# EAGLE design lithium (EAGLE 8.2.1)
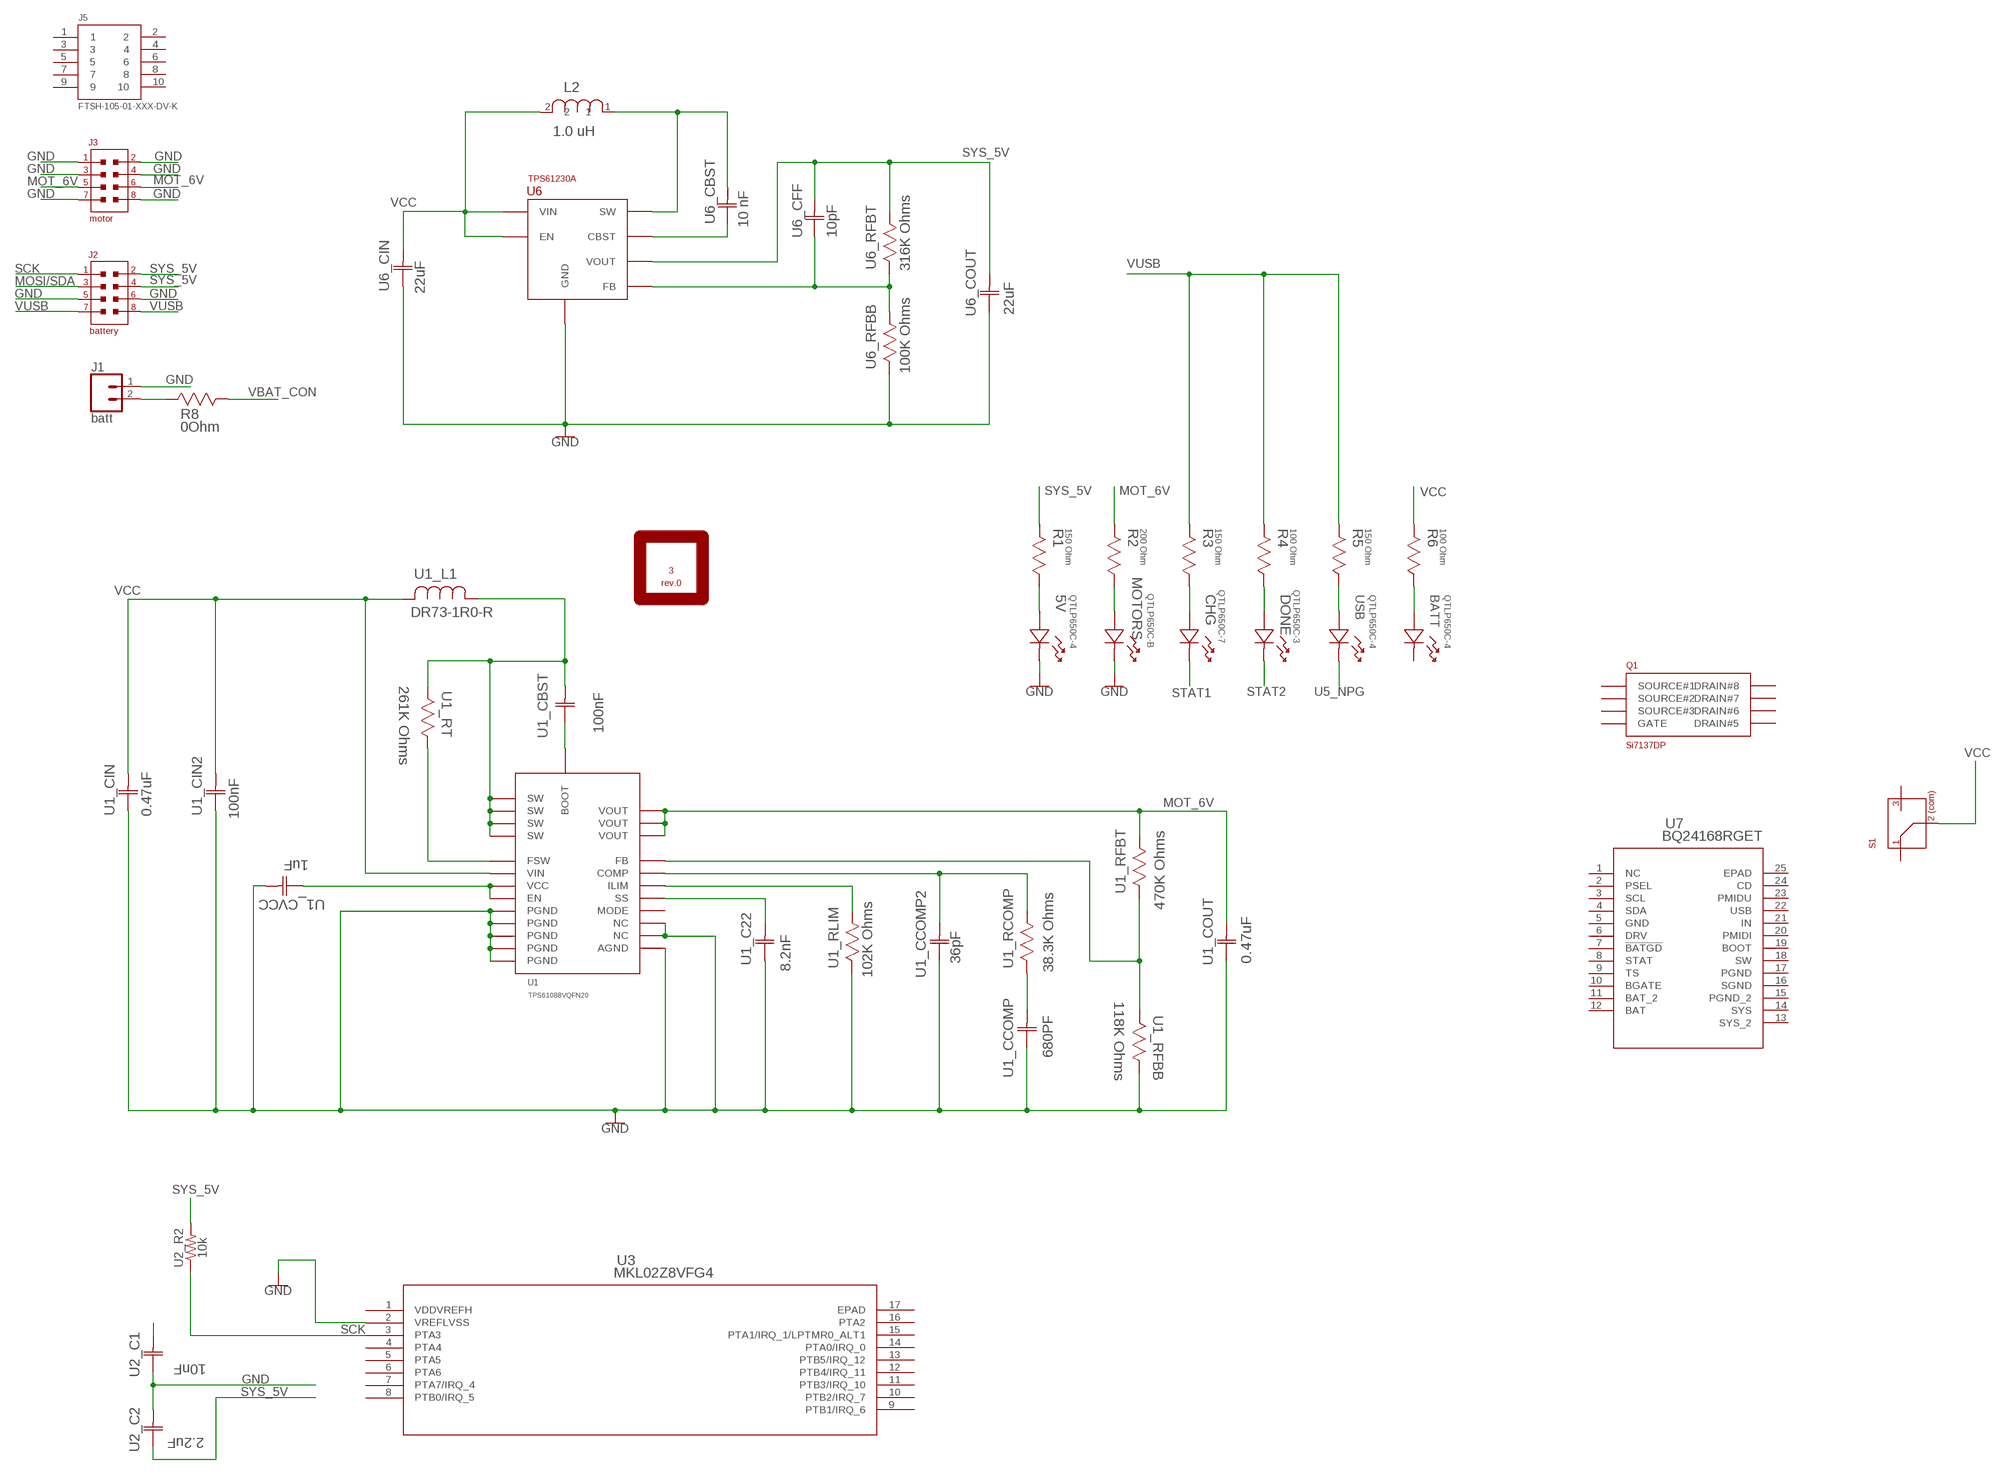
[diagram p0: schematic, sheet 1]

## Parts
3  rev.0  PERIODIC_SYMBOL  [PERIODIC_SYMBOL_BACK]
5V  QTLP650C-4  597-3311-407F  [LED_597-3311-407F]
BATT  QTLP650C-4  597-3311-407F  [LED_597-3311-407F]
CHG  QTLP650C-7  597-3111-407F  [LED_597-3111-407F]
DONE  QTLP650C-3  597-3401-407F  [LED_597-3401-407F]
J1  batt  CONN_02-JST-2MM-SMT  [JST-2-SMD]
J2  battery  2X4-0.01"(2.54MM)-JUMPERSSOCKET  [2X4-0.01"(2.54MM)-SOCKET]
J3  motor  2X4-0.01"(2.54MM)-JUMPERSSOCKET  [2X4-0.01"(2.54MM)-SOCKET]
J5  FTSH-105-01-XXX-DV-K  [FTSH-105-01-XXX-DV-K]
L2  1.0 uH  PM1210-1R0J-RC  [INDC3225X22N]
MOTORS  QTLP650C-B  597-3311-402F  [LED_597-3311-402F]
Q1  Si7137DP  SI7137DP  [SO-8]
R1  150 Ohm  ERA-6AEB151V  [RESC2013X65N]
R2  200 Ohm  ERA-6AEB201V  [RESC2013X65N]
R3  150 Ohm  ERA-6AEB151V  [RESC2013X65N]
R4  100 Ohm  ERA-6AEB101V  [RESC2013X65N]
R5  150 Ohm  ERA-6AEB151V  [RESC2013X65N]
R6  100 Ohm  ERA-6AEB101V  [RESC2013X65N]
R8  0Ohm  CRCW08050000Z0EB  [RESC2013X65N]
S1  SS312SAH4  [SS312SAH4]
U1  TPS61088VQFN20  [VQFN20]
U1_C22  8.2nF  C0402C822K5RACTU  [CAPC1005X60N]
U1_CBST  100nF  08053C104KAT2A  [CAPC2013X94N]
U1_CCOMP  680PF  0603YC681JAT2A  [CAPC1608X90N]
U1_CCOMP2  36pF  C0402C360J5GACTU  [CAPC1005X60N]
U1_CIN  0.47uF  C1206F474K5RACAUTO  [CAPC3216X180N]
U1_CIN2  100nF  GRM155R71C104KA88D  [CAPC1005X60N]
U1_COUT  0.47uF  C1206F474K5RACAUTO  [CAPC3216X180N]
U1_CVCC  1uF  GRM188R60J105KA01D  [CAPC1608X85N]
U1_L1  DR73-1R0-R  [INDM7676X355N]
U1_RCOMP  38.3K Ohms  CRCW040238K3FKED  [RESC1005X40N]
U1_RFBB  118K Ohms  CRCW0402118KFKED  [RESC1005X40N]
U1_RFBT  470K Ohms  RC0603FR-07470KL  [RESC1608X60N]
U1_RLIM  102K Ohms  CRCW0402102KFKED  [RESC1005X40N]
U1_RT  261K Ohms  CRCW0402261KFKED  [RESC1005X40N]
U2_C1  10nF  CC0402KRX7R7BB103  [CAPC1005X55N]
U2_C2  2.2uF  0402ZD225KAT2A  [CAPC1005X60N]
U2_R2  10k  RESISTOR0402  [0402]
U3  MKL02Z8VFG4  [QFN-16_3X3X0.65]
U6  TPS61230A  [VQFN7]
U6_CBST  10 nF  C0402C103K5RACTU  [CAPC1005X60N]
U6_CFF  10pF  C0603C100J5GACTU  [CAPC1608X85N]
U6_CIN  22uF  GRM21BR60J226ME39L  [CAPC2013X135N]
U6_COUT  22uF  GRM32ER61C226KE20L  [CAPC3225X270N]
U6_RFBB  100K Ohms  CRCW0402100KFKED  [RESC1005X40N]
U6_RFBT  316K Ohms  CRCW0402316KFKED  [RESC1005X40N]
U7  BQ24168RGET  [RGE24_2P7X2P7]
USB  QTLP650C-4  597-3311-407F  [LED_597-3311-407F]

## Nets
BOOT: U1.P$8(BOOT) U1_CBST.1(C1)
FB: U1.P$17(FB) U1_RFBB.2 U1_RFBT.2(R2)
FSW: U1.P$3(FSW) U1_RT.1
GND: 5V.1 J1.1 J2.P$5 J2.P$6 J3.P$1 J3.P$2 J3.P$3 J3.P$4 J3.P$7 J3.P$8 MOTORS.1 U1.P$11(NC) U1.P$12(NC) U1.P$20(AGND) U1.P$21(PGND) U1.P$22(PGND) U1.P$23(PGND) U1.P$24(PGND) U1.P$25(PGND) U1_C22.1(C1) U1_CCOMP2.1(C1) U1_CCOMP.1(C1) U1_CIN2.1(C1) U1_CIN.1(C1) U1_COUT.1(C1) U1_CVCC.2(C2) U1_RFBB.1 U1_RLIM.2 U2_C1.1(C1) U2_C2.1(C2) U3.2(VREFLVSS) U6.P$6(GND) U6_CIN.1(C1) U6_COUT.1(C1) U6_RFBB.2
ILIM: U1.P$19(ILIM) U1_RLIM.1
LA_5: 5V.2 R1.1(R1)
LA_6: MOTORS.2 R2.1(R1)
LA_BATT: BATT.2 R6.1(R1)
LA_CHG: CHG.2 R3.1(R1)
LA_DONE: DONE.2 R4.1(R1)
LA_USB: R5.1(R1) USB.2
MOSI/SDA: J2.P$3
MOT_6V: J3.P$5 J3.P$6 R2.2(R2) U1.P$14(VOUT) U1.P$15(VOUT) U1.P$16(VOUT) U1_COUT.2(C2) U1_RFBT.1(R1)
N$1: U1_CCOMP.2(C2) U1_RCOMP.2
SCK: J2.P$1 U2_R2.1 U3.3(PTA3)
SS: U1.P$10(SS) U1_C22.2(C2)
STAT1: CHG.1
STAT2: DONE.1
SW: U1.P$4(SW) U1.P$5(SW) U1.P$6(SW) U1.P$7(SW) U1_CBST.2(C2) U1_L1.1 U1_RT.2
SYS_5V: J2.P$2 J2.P$4 R1.2(R2) U2_C1.2(C2) U2_C2.2(C1) U2_R2.2 U6.P$7(VOUT) U6_CFF.2(C2) U6_COUT.2(C2) U6_RFBT.1
U1_COMP: U1.P$18(COMP) U1_CCOMP2.2(C2) U1_RCOMP.1
U1_VCC: U1.P$1(VCC) U1.P$2(EN) U1_CVCC.1(C1)
U5_NPG: USB.1
U6_CBST: U6.P$1(CBST) U6_CBST.1(C1)
U6_FB: U6.P$3(FB) U6_CFF.1(C1) U6_RFBB.1 U6_RFBT.2
U6_SW: L2.1 U6.P$5(SW) U6_CBST.2(C2)
VBAT_CON: R8.1
VBAT_JST: J1.2 R8.2
VCC: L2.2 R6.2(R2) S1.P$2 U1.P$9(VIN) U1_CIN2.2(C2) U1_CIN.2(C2) U1_L1.2 U6.P$2(EN) U6.P$4(VIN) U6_CIN.2(C2)
VUSB: J2.P$7 J2.P$8 R3.2(R2) R4.2(R2) R5.2(R2)
Unconnected: BATT.1 J5.1 J5.2 J5.3 J5.4 J5.5 J5.6 J5.7 J5.8 J5.9 J5.10 Q1.P$1(SOURCE#1) Q1.P$2(SOURCE#2) Q1.P$3(SOURCE#3) Q1.P$4(GATE) Q1.P$5(DRAIN#5) Q1.P$6(DRAIN#6) Q1.P$7(DRAIN#7) Q1.P$8(DRAIN#8) Q1.P$9(DRAIN#8) S1.P$1 S1.P$3 U1.P$13(MODE) U3.4(PTA4) U3.5(PTA5) U3.6(PTA6) U3.7(PTA7/IRQ_4) U3.8(PTB0/IRQ_5) U3.9(PTB1/IRQ_6) U3.10(PTB2/IRQ_7) U3.11(PTB3/IRQ_10) U3.12(PTB4/IRQ_11) U3.13(PTB5/IRQ_12) U3.14(PTA0/IRQ_0) U3.15(PTA1/IRQ_1/LPTMR0_ALT1) U3.16(PTA2) U3.17(EPAD) U7.1(NC) U7.2(PSEL) U7.3(SCL) U7.4(SDA) U7.6(DRV) U7.7(!BATGD) U7.8(STAT) U7.9(TS) U7.10(BGATE) U7.11(BAT_2) U7.12(BAT) U7.13(SYS_2) U7.14(SYS) U7.18(SW) U7.19(BOOT) U7.20(PMIDI) U7.21(IN) U7.22(USB) U7.23(PMIDU) U7.24(CD) U7.25(EPAD)

## Power pins joined to a net without a drawn wire
GND: U7.5(GND)
PGND: U7.17(PGND)
PGND_2: U7.15(PGND_2)
SGND: U7.16(SGND)
VDDVREFH: U3.1(VDDVREFH)

## Library data of the parts
3 = 32bits:PERIODIC_SYMBOL; ELEMENT: Li
5V BATT USB = Dialight_By_element14_Batch_1:597-3311-407F: LED 1206 Green SMT; COLOR: Green; MPN: 597-3311-407F; OC_FARNELL: 1519493; OC_NEWARK: 30K4957; PACKAGE: 1206- Green LED; SUPPLIER: Dialight
CHG = Dialight_By_element14_Batch_1:597-3111-407F: LED 1206 ALGAAS RED SMT; COLOR: AlGaAs Red; MPN: 597-3111-407F; OC_FARNELL: 1519490; OC_NEWARK: 30K4900; PACKAGE: 1206-RED LED; SUPPLIER: Dialight
DONE = Dialight_By_element14_Batch_1:597-3401-407F: LED 1206 Yellow SMT; COLOR: Yellow; MPN: 597-3401-407F; OC_FARNELL: 1519495; OC_NEWARK: 30K4970; PACKAGE: 1206-Yellow LED; SUPPLIER: Dialight
J1 = SparkFun-Connectors:CONN_02: Multi connection point. Often used as Generic Header-pin footprint for 0.1 inch spaced/style header connections On any of the 0.1 inch spaced packages, you can populate with these: Break Away Headers - Straight <https://www.sparkfun.com/products/116> (PRT-00116) Break Away Male Headers - Right Angle <https://www.sparkfun.com/products/553> (PRT-00553) Female Headers <https://www.sparkfun.com/products/115> (PRT-00115) Break Away Headers - Machine Pin <https://www.sparkfun.com/products/117> (PRT-00117) Break Away Female Headers - Swiss Machine Pin <https://www.sparkfun.com/products/743> (PRT-00743) For SCREWTERMINALS and SPRING TERMINALS visit here: Screw Terimnals on SparkFun.com <https://www.sparkfun.com/search/results?term=Screw+Terminals> (5mm/3.5mm/2.54mm spacing) This device is also useful as a general connection point to wire up your design to another part of your project. Our various solder wires solder well into these plated through hole pads. Hook-Up Wire - Assortment (Stranded, 22 AWG) <https://www.sparkfun.com/products/11375> (PRT-11375) Hook-Up Wire - Assortment (Solid Core, 22 AWG) <https://www.sparkfun.com/products/11367> (PRT-11367) View the entire wire category on our website here <https://www.sparkfun.com/categories/141> Special notes: Molex polarized connector foot print use with: PRT-08233 with associated crimp pins and housings. 2.54_SCREWTERM for use with PRT-10571. 3.5mm Screw Terminal footprints for PRT-08084 5mm Screw Terminal footprints for use with PRT-08432; PROD_ID: CONN-11443
J2 J3 = 32bits:2X4-0.01"(2.54MM)-JUMPERS: Variant Manufacturer part no. HEADERS Amphenol FCI 95278-101A10LF SOCKET Sullins NPxCxx2KFMx-RC
J5 = FTSH-105-01-XXX-DV-K:FTSH-105-01-XXX-DV-K: 0.05"x0.05" DOUBLE ROW SMT STRIP ASSEMBLY. MANUFACTURER:SAMTEC.
L2 = Bourns_By_element14_Batch_1:PM1210-1R0J-RC: CHIP INDUCTOR, 1UH, 400MA 5% 120MHZ; MPN: PM1210-1R0J-RC; OC_FARNELL: 1180462; OC_NEWARK: 63K3090; SUPPLIER: BOURNS; TOLERANCE: ±5 %
MOTORS = Dialight_By_element14_Batch_1:597-3311-402F: LED 1206 Green SMT; COLOR: Green; MPN: 597-3311-402F; OC_FARNELL: 1179613; OC_NEWARK: 30K4956; PACKAGE: 1206- Green LED; SUPPLIER: Dialight
Q1 = 32bits:SI7137DP: P-Channel 20-V (D-S) MOSFET Vishay Siliconix RDS: 0.0025 at VGS = - 4.5 V
R1 R3 R5 = Panasonic_By_element14_Batch_1:ERA-6AEB151V: RESISTOR, 0805; MPN: ERA-6AEB151V; OC_FARNELL: 1811409; OC_NEWARK: 08N2149; SUPPLIER: Panasonic; TOLERANCE: ±0.1 %; WATTAGE: 0.125 W
R2 = Panasonic_By_element14_Batch_1:ERA-6AEB201V: RESISTOR, 0805; MPN: ERA-6AEB201V; OC_FARNELL: 1670217; OC_NEWARK: 40P0007; SUPPLIER: Panasonic; TOLERANCE: ±0.1 %; WATTAGE: 0.125 W
R4 R6 = Panasonic_By_element14_Batch_1:ERA-6AEB101V: RESISTOR, 0805; MPN: ERA-6AEB101V; OC_FARNELL: 1811403; OC_NEWARK: 08N2140; SUPPLIER: Panasonic; TOLERANCE: ±0.1 %; WATTAGE: 0.125 W
R8 = Vishay_By_element14_Batch_1:CRCW08050000Z0EB: RESISTOR, 0805; MPN: CRCW08050000Z0EB; OC_FARNELL: 1853266; OC_NEWARK: 48P9971; SUPPLIER: Vishay; TOLERANCE: Jumper; WATTAGE: 0.125W
S1 = 32bits:SS312SAH4: NKK Switches SS312SAH4 ON-ON, SPDT
U1 = 32bits:TPS61088: TPS61088 10-A Fully-Integrated Synchronous Boost Converter Input Voltage Range: 2.7 to 12 V Output Voltage Range: 4.5 to 12.6 V 10-A Switch Current Up to 91% Efficiency at VIN = 3.3 V, VOUT = 9 V, and IOUT = 3 A Mode Selection Between PFM Mode and ForcedPWM Mode at Light Load 1.0 μA Current into VIN Pin during Shutdown Resistor-Programmable Switch Peak Current Limit Adjustable Switching Frequency: 200 kHz to 2.2MHz Programmable Soft Start Output Overvoltage Protection at 13.2 V Cycle-by-Cycle Overcurrent Protection Thermal Shutdown 4.50-mm × 3.50-mm 20-Pin VQFN Package Description The TPS61088 is a high power density, fully integrated synchronous boost converter with a 11-mΩ power switch and a 13-mΩ rectifier switch to provide a high efficiency and small size solution in portable systems. The TPS61088 has wide input voltage range from 2.7 V to 12 V to support applications with single cell or two cell Lithium batteries. The device has 10-A switch current capability and is capable of providing an output voltage up to 12.6 V. The TPS61088 uses adaptive constant off-time peak current control topology to regulate the output voltage. In moderate to heavy load condition, the TPS61088 works in the pulse width modulation (PWM) mode. In light load condition, the device has two operation modes selected by the MODE pin. One is the pulse frequency modulation (PFM) mode to improve the efficiency and another one is the forced PWM mode to avoid application problems caused by low switching frequency. The switching frequency in the PWM mode is adjustable ranging from 200 kHz to 2.2 MHz by an external resistor. The TPS61088 also implements a programmable soft-start function and an adjustable switching peak current limit function. In addition, the device provides 13.2-V output overvoltage protection, cycle-by-cycle overcurrent protection, and thermal shutdown protection. The TPS61088 is available in a 4.50-mm × 3.50-mm 20-pin VQFN package.; TYPE: boost
U1_C22 = Kemet_By_element14_Batch_1:C0402C822K5RACTU: CAPACITOR, 0402; MPN: C0402C822K5RACTU; OC_FARNELL: 1865460; OC_NEWARK: 29T8966; SUPPLIER: KEMET; TOLERANCE: ±10%; VOLTAGERATING: 50V
U1_CBST = AVX_By_element14_Batch_1:08053C104KAT2A: Capacitor 0805; MPN: 08053C104KAT2A; OC_FARNELL: 1740665; OC_NEWARK: 96M1381; SUPPLIER: AVX; TOLERANCE: ±10%; VOLTAGERATING: 25V
U1_CCOMP = AVX_By_element14_Batch_1:0603YC681JAT2A: Capacitor, 0603; MPN: 0603YC681JAT2A; OC_FARNELL: -; OC_NEWARK: 55J2711; SUPPLIER: AVX; TOLERANCE: ±5%; VOLTAGERATING: 16V
U1_CCOMP2 = Kemet_By_element14_Batch_1:C0402C360J5GACTU: CAPACITOR, 0402; MPN: C0402C360J5GACTU; OC_FARNELL: 1865427; OC_NEWARK: 29T8949; SUPPLIER: KEMET; TOLERANCE: ±5%; VOLTAGERATING: 50V
U1_CIN U1_COUT = Kemet_By_element14_Batch_1:C1206F474K5RACAUTO: CAPACITOR, 1206; MPN: C1206F474K5RACAUTO; OC_FARNELL: 1869060; OC_NEWARK: 32T6755; SUPPLIER: KEMET; TOLERANCE: ±10%; VOLTAGERATING: 50V
U1_CIN2 = Murata_By_element14_Batch_1:GRM155R71C104KA88D: CAPACITOR, 0402; MPN: GRM155R71C104KA88D; OC_FARNELL: 8819742; OC_NEWARK: 38K1647; SUPPLIER: Murata; TOLERANCE: ±10%; VOLTAGERATING: 16V
U1_CVCC = Murata_By_element14_Batch_1:GRM188R60J105KA01D: CAPACITOR, 0603; MPN: GRM188R60J105KA01D; OC_FARNELL: 9527699; OC_NEWARK: 97K0609; SUPPLIER: Murata; TOLERANCE: ±10%; VOLTAGERATING: 6.3V
U1_L1 = Coiltronics_By_element14_Batch_1:DR73-1R0-R: POWER INDUCTOR; CURRENTRATING: 5.28A; INDUCTANCE: 1µH; MPN: DR73-1R0-R; OC_FARNELL: 1463503; OC_NEWARK: 29K6167; PACKAGE: SMD; SUPPLIER: COILTRONICS; TOLERANCE: ±20%
U1_RCOMP = Vishay_By_element14_Batch_1:CRCW040238K3FKED: RESISTOR, 0402; MPN: CRCW040238K3FKED; OC_FARNELL: 1151219; OC_NEWARK: 52K7021; SUPPLIER: VISHAY DALE ELECTRONICS; TOLERANCE: ±1%; WATTAGE: 0.063 W
U1_RFBB = Vishay_By_element14_Batch_1:CRCW0402118KFKED: RESISTOR, 0402; MPN: CRCW0402118KFKED; OC_FARNELL: 1652743; OC_NEWARK: 52K6643; SUPPLIER: Vishay; TOLERANCE: ±1%; WATTAGE: 0.063W
U1_RFBT = Yageo_By_element14_Batch_1:RC0603FR-07470KL: RESISTOR, 0603; MPN: RC0603FR-07470KL; OC_FARNELL: 1117267; OC_NEWARK: 68R0098; SUPPLIER: Yageo; TOLERANCE: ±1%; WATTAGE: 1/10 W
U1_RLIM = Vishay_By_element14_Batch_1:CRCW0402102KFKED: RESISTOR, 0402; MPN: CRCW0402102KFKED; OC_FARNELL: 1150767; OC_NEWARK: 52K6611; SUPPLIER: VISHAY DALE ELECTRONICS; TOLERANCE: ±1%; WATTAGE: 0.063 W
U1_RT = Vishay_By_element14_Batch_1:CRCW0402261KFKED: RESISTOR, 0402; MPN: CRCW0402261KFKED; OC_FARNELL: 1151087; OC_NEWARK: 52K6902; SUPPLIER: VISHAY DALE ELECTRONICS; TOLERANCE: ±1%; WATTAGE: 0.063 W
U2_C1 = Yageo_By_element14_Batch_1:CC0402KRX7R7BB103: CAPACITOR, 0402; MPN: CC0402KRX7R7BB103; OC_FARNELL: 3019275; OC_NEWARK: 68R4639; SUPPLIER: Yageo; TOLERANCE: ±10%; VOLTAGERATING: 16V
U2_C2 = AVX_By_element14_Batch_1:0402ZD225KAT2A: Capacitor 0402; MPN: 0402ZD225KAT2A; OC_FARNELL: 1867952; OC_NEWARK: -; SUPPLIER: AVX; TOLERANCE: ±10%; VOLTAGERATING: 10V
U2_R2 = SparkFun-Resistors:RESISTOR: Generic Resistor Package
U3 = 32bits:MKL02Z8VFG4; CPU: ARM CortexM0+; FLASHKB: 8; MANUFACTURER_PART_NUMBER: mkl02z8vfg4; MAXFREQUENCY: 48; PINCOUNT: 16; SRAMKB: 1; VENDOR: FREESCALE
U6 = 32bits:TPS61230A
U6_CBST = Kemet_By_element14_Batch_1:C0402C103K5RACTU: CAPACITOR, 0402; MPN: C0402C103K5RACTU; OC_FARNELL: 1414575; OC_NEWARK: 78H4783; SUPPLIER: Kemet; TOLERANCE: ±10%; VOLTAGERATING: 50V
U6_CFF = Kemet_By_element14_Batch_1:C0603C100J5GACTU: CAPACITOR, 0603; MPN: C0603C100J5GACTU; OC_FARNELL: 1414601; OC_NEWARK: 64K2831; SUPPLIER: Kemet; TOLERANCE: ±5%; VOLTAGERATING: 50V
U6_CIN = Murata_By_element14_Batch_1:GRM21BR60J226ME39L: CAPACITOR, 0805; MPN: GRM21BR60J226ME39L; OC_FARNELL: 1735531; OC_NEWARK: 24R6338; SUPPLIER: Murata; TOLERANCE: ±20%; VOLTAGERATING: 6.3V
U6_COUT = Murata_By_element14_Batch_1:GRM32ER61C226KE20L: CAPACITOR, 1210; MPN: GRM32ER61C226KE20L; OC_FARNELL: 9527800; OC_NEWARK: 97K0673; SUPPLIER: Murata; TOLERANCE: ±10%; VOLTAGERATING: 16V
U6_RFBB = Vishay_By_element14_Batch_1:CRCW0402100KFKED: RESISTOR, 0402; MPN: CRCW0402100KFKED; OC_FARNELL: 1469671; OC_NEWARK: -; SUPPLIER: Vishay; TOLERANCE: ±1%; WATTAGE: 0.063W
U6_RFBT = Vishay_By_element14_Batch_1:CRCW0402316KFKED: RESISTOR, 0402; MPN: CRCW0402316KFKED; OC_FARNELL: 1652782; OC_NEWARK: 52K6969; SUPPLIER: Vishay; TOLERANCE: ±1%; WATTAGE: 0.063W
U7 = 32bits:BQ24168RGET; MANUFACTURER_PART_NUMBER: bq24168rget; VENDOR: Texas Instruments

## Module TESTMOD
Ports: 

### Library data of the parts

## Board
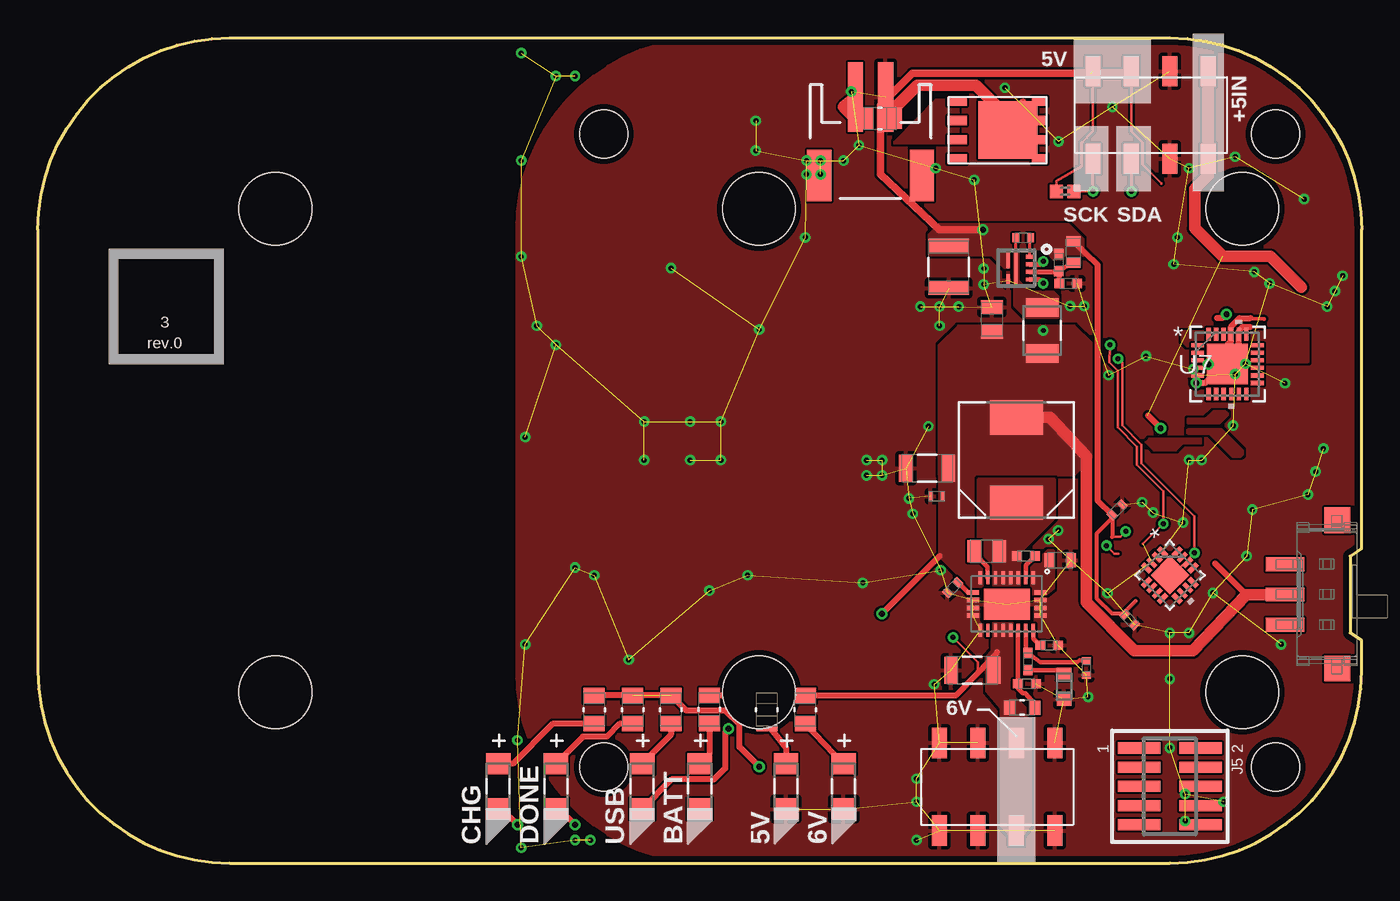
[diagram p1: board, top side]
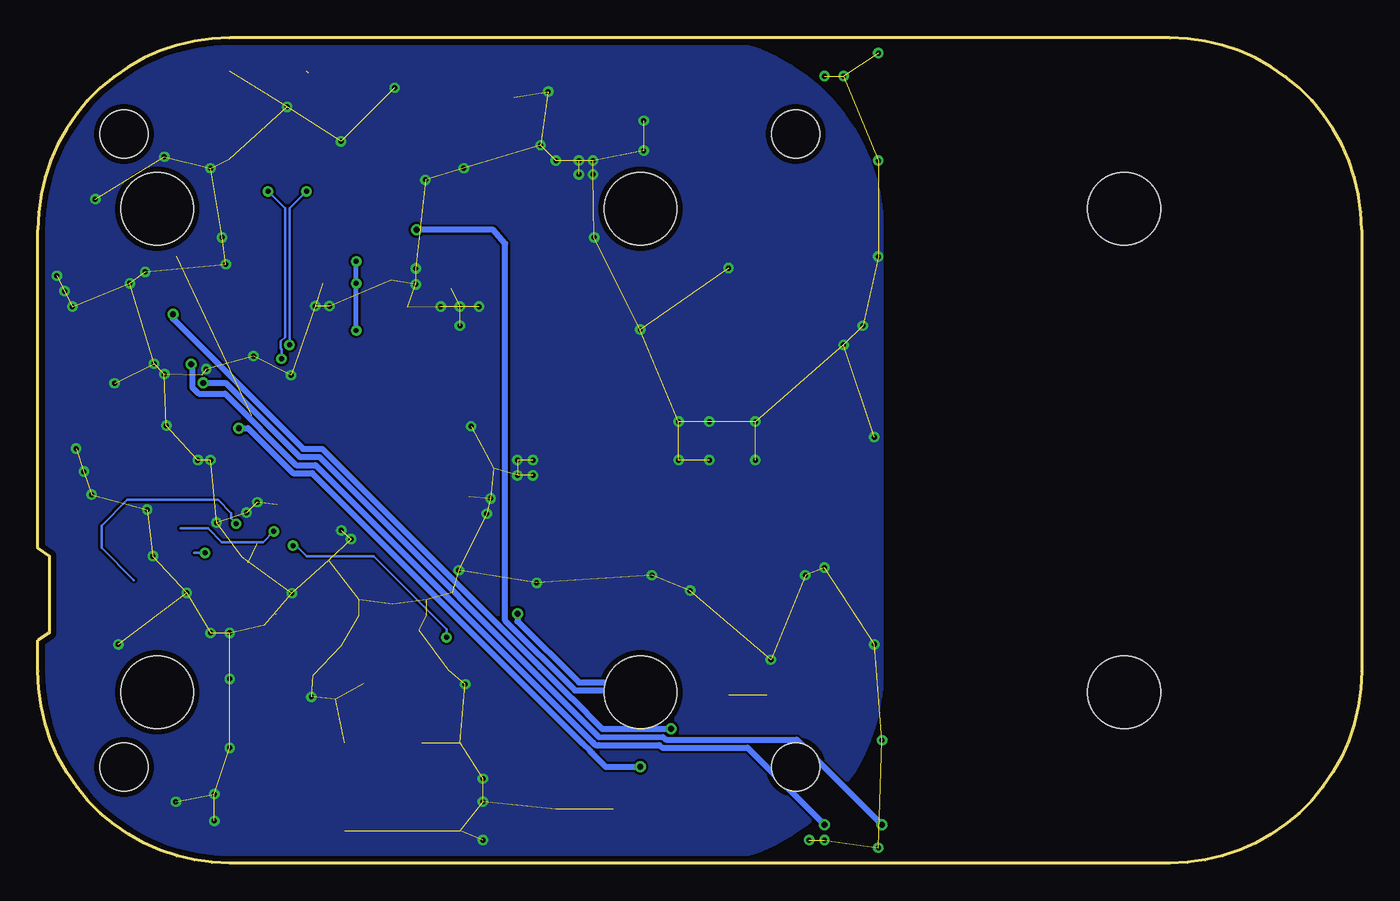
[diagram p2: board, bottom side, seen from below]

Size 87.63 x 54.61 mm. Coordinates in mm from the lower left corner, seen from the top.
Outline: 0,41.91 0,12.7 arc90 12.7,0 74.93,0 arc90 87.63,12.7 87.63,14.73 86.87,15.24 86.87,20.32 87.63,20.83 87.63,41.91 arc90 74.93,54.61 12.7,54.61 arc90 0,41.91
Copper layers (1*16): Top 0.0356mm / dielectric 1.5011mm / Bottom 0.0356mm
Design rules "oshpark-2layer": minimum track width 6mil, minimum drill 13mil, track to track 6mil, track to pad 6mil, pad to pad 6mil, via to via 6mil, smd to smd 6mil, copper to edge 15mil, drill to drill 6mil, minimum pad ring 7mil, minimum via ring 7mil, stop-mask expansion 2.5mil, vias tented up to drill 0mil, thermal gap 10mil
Holes 3.17 mm at 81.92,6.35 81.92,48.26 37.47,48.26 37.47,6.35
Holes 4.8 mm at 79.73,43.3 79.73,11.3 47.73,43.3 47.73,11.3 15.73,43.3 15.73,11.3

### Footprints (pad centres in the part's own frame; a part is rotated, then mirrored left to right if it is on the bottom)
LED_597-3311-407F = smd 1.397 x 1.6: 1 -1.499,0; 2 1.499,0
LED_597-3111-407F = smd 1.397 x 1.6: 1 -1.499,0; 2 1.499,0
LED_597-3401-407F = smd 1.397 x 1.6: 1 -1.499,0; 2 1.499,0
JST-2-SMD = smd 1 x 4.6: 1 -1,-3.7; 2 1,-3.7 | smd 1.6 x 3.4: NC1 -3.4,1.5; NC2 3.4,1.5
2X4-0.01"(2.54MM)-SOCKET = smd 0.991 x 2.007: P$1 0,-1.651; P$2 0,4.14; P$3 2.54,-1.651; P$4 2.54,4.14; P$5 5.08,-1.651; P$6 5.08,4.14; P$7 7.62,-1.651; P$8 7.62,4.14
FTSH-105-01-XXX-DV-K = smd 0.737 x 2.794: 1 -2.54,-2.032; 2 -2.54,2.032; 3 -1.27,-2.032; 4 -1.27,2.032; 5 0,-2.032; 6 0,2.032; 7 1.27,-2.032; 8 1.27,2.032; 9 2.54,-2.032; 10 2.54,2.032
INDC3225X22N = smd 1.245 x 2.159: 1 -1.524,0; 2 1.524,0
LED_597-3311-402F = smd 1.397 x 1.6: 1 -1.499,0; 2 1.499,0
SO-8 = smd 1.27 x 0.61: P$1 0,0; P$2 0,-1.27; P$3 0,-2.54; P$4 0,-3.81 | smd 1.016 x 0.61: P$5 5.461,-3.81; P$6 5.461,-2.54; P$7 5.461,-1.27; P$8 5.461,0 | smd 3.912 x 3.81: P$9 3.353,-1.905
RESC2013X65N = smd 1.016 x 1.397: 1 -0.94,0; 2 0.94,0
SS312SAH4 = smd 1.702 x 1.702: NC$1 4.902,-3.462; NC$2 -4.902,-3.462 | smd 0.914 x 2.55: P$1 2.007,0; P$2 0,0; P$3 -2.007,0
VQFN20 = smd 0.85 x 0.28: P$1 -2.225,-0.75; P$10 2.225,-0.75; P$11 2.225,0.75; P$20 -2.225,0.75; P$21 -2.225,0.275; P$22 -2.225,-0.275; P$23 2.225,-0.275; P$24 2.225,0.275 | smd 0.28 x 0.85: P$2 -1.75,-1.725; P$3 -1.25,-1.725; P$4 -0.75,-1.725; P$5 -0.25,-1.725; P$6 0.25,-1.725; P$7 0.75,-1.725; P$8 1.25,-1.725; P$9 1.75,-1.725; P$12 1.75,1.725; P$13 1.25,1.725; P$14 0.75,1.725; P$15 0.25,1.725; P$16 -0.25,1.725; P$17 -0.75,1.725; P$18 -1.25,1.725; P$19 -1.75,1.725 | smd 3.05 x 2.05: P$25 0,0
CAPC1005X60N = smd 0.457 x 0.61: 1 -0.483,0; 2 0.483,0
CAPC2013X94N = smd 0.914 x 1.448: 1 -0.813,0; 2 0.813,0
CAPC1608X90N = smd 0.864 x 0.965: 1 -0.813,0; 2 0.813,0
CAPC3216X180N = smd 0.914 x 1.803: 1 -1.397,0; 2 1.397,0
CAPC1005X60N' = smd 0.305 x 0.61: 1 -0.406,0; 2 0.406,0
CAPC1608X85N = smd 0.66 x 0.94: 1 -0.711,0; 2 0.711,0
INDM7676X355N = smd 2.261 x 3.505: 1 -2.819,0; 2 2.819,0
RESC1005X40N = smd 0.66 x 0.61: 1 -0.584,0; 2 0.584,0
RESC1608X60N = smd 0.762 x 0.94: 1 -0.838,0; 2 0.838,0
CAPC1005X55N = smd 0.457 x 0.61: 1 -0.483,0; 2 0.483,0
0402 = smd 0.85 x 0.9: 1 -0.58,0; 2 0.58,0
QFN-16_3X3X0.65 = smd 0.755 x 0.3: 1 -1.427,0.75; 2 -1.427,0.25; 3 -1.427,-0.25; 4 -1.427,-0.75; 9 1.427,-0.75; 10 1.427,-0.25; 11 1.427,0.25; 12 1.427,0.75 | smd 0.3 x 0.755: 5 -0.75,-1.427; 6 -0.25,-1.427; 7 0.25,-1.427; 8 0.75,-1.427; 13 0.75,1.427; 14 0.25,1.427; 15 -0.25,1.427; 16 -0.75,1.427 | smd 1.8 x 1.8: 17 0,0
VQFN7 = smd 0.25 x 0.6: P$1 -0.75,0.9; P$2 -0.25,0.9; P$3 0.25,0.9; P$4 0.75,0.9 | smd 2.38 x 0.25: P$5 0,-0.015 | smd 0.8 x 0.3: P$6 0.8,-0.54 | smd 1.2 x 0.3: P$7 -0.6,-0.54
CAPC2013X135N = smd 0.914 x 1.448: 1 -0.813,0; 2 0.813,0
CAPC3225X270N = smd 0.914 x 2.692: 1 -1.397,0; 2 1.397,0
RGE24_2P7X2P7 = smd 0.85 x 0.28: 1 -1.975,1.25; 2 -1.975,0.75; 3 -1.975,0.25; 4 -1.975,-0.25; 5 -1.975,-0.75; 6 -1.975,-1.25; 13 1.975,-1.25; 14 1.975,-0.75; 15 1.975,-0.25; 16 1.975,0.25; 17 1.975,0.75; 18 1.975,1.25 | smd 0.28 x 0.85: 7 -1.25,-1.975; 8 -0.75,-1.975; 9 -0.25,-1.975; 10 0.25,-1.975; 11 0.75,-1.975; 12 1.25,-1.975; 19 1.25,1.975; 20 0.75,1.975; 21 0.25,1.975; 22 -0.25,1.975; 23 -0.75,1.975; 24 -1.25,1.975 | smd 2.7 x 2.7: 25 0,0

### Placement (x,y rotation side)
3  11.05,34.29 0 bottom
5V  49.53,5.08 90 top
BATT  43.81,5.08 90 top
CHG  30.48,5.08 90 top
DONE  34.29,5.08 90 top
J1  55.12,46.99 180 top
J2  69.85,48.26 0 top
J3  59.69,3.81 0 top
J5  74.93,5.08 270 top
L2  66.48,35.24 270 top
MOTORS  53.34,5.08 90 top
Q1  60.86,50.41 0 top
R1  48.26,10.16 90 top
R2  50.8,10.16 90 top
R3  36.83,10.16 90 top
R4  39.37,10.16 90 top
R5  41.91,10.16 90 top
R6  44.45,10.17 90 top
R8  55.75,49.28 180 top
S1  82.55,17.78 90 top
U1  64.14,17.14 180 top
U1_C22  60.56,18.23 45 top
U1_CBST  62.8,20.64 0 top
U1_CCOMP  67.92,11.67 90 top
U1_CCOMP2  69.4,12.92 90 top
U1_CIN  58.86,26.12 0 top
U1_CIN2  100nF  [CAPC1005X60N']  59.5,24.28 0 top
U1_COUT  61.85,12.76 0 top
U1_CVCC  67.68,20.04 0 top
U1_L1  64.77,26.67 90 top
U1_RCOMP  65.53,13.34 270 top
U1_RFBB  65.47,11.87 180 top
U1_RFBT  65.15,10.29 0 top
U1_RLIM  66.93,14.41 0 top
U1_RT  65.41,20.32 180 top
U2_C1  71.45,23.37 225 top
U2_C2  72.26,16.11 135 top
U2_R2  68,44.45 180 top
U3  74.93,19.05 315 top
U6  64.77,39.37 270 top
U6_CBST  65.21,41.38 180 top
U6_CFF  68.54,40.44 90 top
U6_CIN  63.14,35.98 270 top
U6_COUT  60.3,39.45 90 top
U6_RFBB  68.2,38.35 0 top
U6_RFBT  67.56,39.75 270 top
U7  78.74,33.02 0 top
USB  40.01,5.08 90 top

### Tracks (layer width: path | path; a pad name or v marks a point on that pad's centre or on a via)
BOOT
  Top 0.305: U1_CBST.1 61.99,20.5 62.87,19.62 62.87,18.89 U1.P$8
FB
  Top 0.305: U1.P$17 64.89,12.76 U1_RFBB.2 64.88,11.57 65.22,11.24 | 65.22,11.24 65.2,11.24 | 65.22,11.24 65.38,11.24 66.17,10.3 U1_RFBT.2
FSW
  Top 0.305: U1.P$3 65.39,19.72 U1_RT.1
GND  (via drill 0.33)  (137 unrouted)
  other vias: 33.02,35.56 41.91,39.37 34.29,34.29 40.13,29.21 43.18,29.21 45.21,29.21 45.21,26.67 43.18,26.67 40.13,26.67 35.56,19.56 36.83,19.05 59.69,35.56 59.69,36.83 60.96,36.83 58.42,36.83 62.61,39.34 62.61,38.29 73.36,33.55 76.48,32.69 79.25,32.36 79.93,33.05 69.27,36.86 68.33,36.86 67.54,22.02 66.9,21.44 73.1,23.88 73.81,23.19 70.87,32.28 75.79,22.53 77.77,17.88 76.2,15.24 74.93,15.24 70.82,17.86 76.2,26.67 77.04,26.67 80.01,20.32 79.12,28.96 82.55,31.75 55.88,26.67 55.88,25.65 54.86,26.67 54.86,25.65 57.66,24.13 57.91,23.11 34.29,52.07 35.56,52.07 44.45,18.03 46.99,19.05 54.61,18.54 36.58,1.52 35.56,1.52 58.17,1.52 58.17,4.06 58.17,5.59 75.95,2.79 75.95,4.57 74.93,7.62 78.49,4.06 39.12,13.46 47.75,35.31 50.8,41.4 53.34,46.48 54.36,47.5 51.82,46.48 53.85,51.05 59.44,45.97 74.93,12.19 82.3,14.48 84.07,24.38 84.58,25.91 85.09,27.43 85.85,37.85 85.34,36.83 86.36,38.86 83.82,43.94 75.18,39.62 81.53,38.35 80.52,39.12 76.2,45.97 75.44,41.4 71.12,50.04 79.25,46.74 64.01,51.31 61.98,45.21 67.56,47.75 31.75,8.13 32.26,14.48 32,40.13 32,46.48 32,53.59 32.26,28.19 32,1.02 69.52,11 59.33,11.84 59.77,19.38 80.39,23.39 50.88,46.48 51.82,45.57 50.88,45.57 47.52,47.14 47.52,49.12 58.95,28.91
  pour Top (rank 4): 44.45,54.61 74.93,54.61 arc-90 87.63,41.91 87.63,12.7 arc-90 74.93,0 44.45,0 arc-90 31.75,12.7 31.75,41.91 arc-90
  pour Bottom (rank 4): 44.45,54.61 74.93,54.61 arc-90 87.63,41.91 87.63,12.7 arc-90 74.93,0 44.45,0 arc-90 31.75,12.7 31.75,41.91 arc-90
ILIM
  Top 0.305: U1.P$19 65.89,14.85 U1_RLIM.1
LA_5
  Top 0.381: R1.1 49.53,7.62 5V.2
LA_6
  Top 0.381: R2.1 MOTORS.2
LA_BATT
  Top 0.381: R6.1 44.45,7.21 BATT.2
LA_CHG
  Top 0.381: R3.1 34.09,9.22 31.45,6.58 CHG.2
LA_DONE
  Top 0.381: R4.1 38.52,9.22 37.67,8.37 36.08,8.37 DONE.2
LA_USB
  Top 0.381: R5.1 41.91,8.48 USB.2
MOSI/SDA  (via drill 0.33)
  Top 0.152: 75.72,19.69 v76.56,20.52 76.56,22.97 73.05,26.47 73.05,27.69 71.78,28.96 71.78,33.1 v71.5,33.38 | v72.39,44.45 J2.P$3
  Bottom 0.152: v76.56,20.52 77.27,20.52 | v72.39,44.45 71.27,43.33 71.27,34.79 71.54,34.53 71.54,34.05 71.5,34.01 v71.5,33.38
MOT_6V  (via drill 0.33)
  Top 0.152: v70.74,21.01 71.27,20.47 71.53,20.47 | 62.23,12.6 62.23,13.28 v60.58,14.93
  Top 0.381: R2.2 60.76,11.1 62.23,12.6 63.5,13.97
  Bottom 0.152: v70.74,21.01 70.54,21.01 69.85,20.32 65.39,20.32 60.58,15.49 v60.58,14.93
  pour Top (no thermals): 63.18,17.14 64.58,17.14 64.64,10.99 65.68,9.98 65.68,2.46 65.18,1.83 64.34,1.83 63.79,2.45 63.79,10.22 62.81,11.35 62.8,13.65 63.18,14.1
N$1
  Top 0.305: U1_RCOMP.2 67.44,12.75 U1_CCOMP.2
S1_U4OUT
  pour Top (no thermals): 76.12,28.7 78.33,28.7 79.58,27.46 79.73,27.3 79.73,27.05 79.58,26.9 79.1,26.9 77.57,28.42 76.12,28.42
SCK  (via drill 0.33)  (1 unrouted)
  Top 0.152: J2.P$1 v69.85,44.45 U2_R2.1 | 73.14,21.12 v74.5,22.45 74.5,24.59 72.75,26.34 72.75,27.56 71.48,28.83 71.48,32.59 70.93,33.14 70.93,33.61 70.97,33.65 v70.97,34.29
  Bottom 0.152: 81.28,18.73 83.41,20.86 83.41,22.32 81.7,24.03 75.69,24.03 74.83,23.16 74.83,22.81 v74.5,22.45 | v70.97,34.29 70.97,43.33 v69.85,44.45
SS
  Top 0.305: U1.P$10 61.58,17.89 U1_C22.2
STAT1  (via drill 0.38)
  Top 0.203: 80.24,35.48 81.15,35.48
  Top 0.381: v76.68,31.78 77.27,31.78 79.5,34.01 79.5,35.23 79.76,35.48 80.24,35.48 | CHG.1 30.71,3.58 v31.75,2.54
  Bottom 0.381: v76.68,31.78 75.19,31.78 70.29,26.87 69.02,26.87 50.49,8.35 46.28,8.35 46.06,8.18 37.39,8.18 v31.75,2.54
STAT2  (via drill 0.38)
  Top 0.254: 80.26,36.05 81.17,36
  Top 0.381: DONE.1 34.52,3.58 v35.56,2.54 | v77.47,33.01 78.74,34.29 78.97,34.52 78.97,35.48 79.54,36.05 80.26,36.05
  Bottom 0.381: 77.44,32.98 v77.47,33.01 77.39,32.93 77.39,31.48 76.98,31.06 75.24,31.06 70.51,26.34 69.24,26.34 51.03,8.12 | v35.56,2.54 40.66,7.64 40.69,7.62 46.25,7.62 46.28,7.64 46.5,7.82 50.49,7.81 50.72,7.81 50.87,7.97 51.03,8.12 | 51.03,8.12
SW
  pour Top (no thermals): 62.23,25.4 62.23,20.26 63.25,19.24 63.25,18.41 65.02,18.41 65.02,20.57 67.31,22.86 67.31,25.4
SYS_5V  (via drill 0.33, 0.38)  (2 unrouted)
  Top 0.152: 71.12,21.59 71.65,21.59 v72.01,21.95 | 74.37,44.96 74.37,44.99 73.11,46.25 73.11,47.71 72.39,48.43 J2.P$4 | U2_R2.2 67.42,45.11 67.44,45.14 69.09,46.12 69.09,47.67 69.85,48.43 J2.P$2
  Top 0.254: 71.83,16.51 72.67,17.34 | 71.83,16.51 71.12,16.51 70.1,17.5 70.1,21.84 71.12,22.86 71.12,21.59 | 71.81,16.49 71.83,16.51
  Top 0.381: 71.12,22.86 71.12,23.05 70.16,23.98 70.16,39.59 U6_CFF.2 | R1.2 49.43,11.1 v49.53,11.07
  Top 0.406: U2_C1.2 71.12,22.86
  Top 0.508: J2.P$4 72.33,52.26 69.71,52.26 57.9,52.26 55.78,50.14 55.78,45.57 59.69,41.91 v62.56,41.91
  Bottom 0.152: v72.01,21.95 72.71,21.25 75.45,21.25 76.35,22.15 78.18,22.15
  Bottom 0.381: v49.53,11.07 49.88,11.43 52.04,11.43 52.05,11.43 52.07,11.43 56.69,16.05 56.69,41 57.51,41.91 v62.56,41.91
  pour Top (no thermals): 58.99,40.26 63.12,40.26 63.94,39.43 64.26,39.43 64.26,40.64 66.55,40.64 67.18,40 69.22,40 69.22,41.27 68.26,42.23 59.63,42.23 58.99,41.59
U1_COMP
  Top 0.305: U1.P$18 65.39,14.07 U1_RCOMP.1 66.34,13.28 68.78,13.28 68.96,13.41 U1_CCOMP2.2
U1_VCC
  pour Top (no thermals): 65.79,17.78 65.79,19.62 66.87,20.7 67.21,20.7 67.21,18.17 66.74,17.78
U5_NPG  (via drill 0.38)
  Top 0.381: v78.68,36.32 78.42,36.06 78.05,36.06 | v45.72,8.89 45.49,8.66 45.49,6.27 44.76,5.54 41.96,5.54 USB.1
  Bottom 0.381: v78.68,36.32 78.68,36.01 70.07,27.41 68.8,27.41 54.35,12.96 54.05,12.66 52.29,10.9 52.27,10.9 50.27,8.89 v45.72,8.89 45.85,9.02
U6_CBST
  Top 0.203: U6.P$1 65.67,41.35 U6_CBST.1
U6_FB
  Top 0.33: U6.P$3 67.24,39.12 U6_RFBT.2 | U6_CFF.1 U6_RFBT.2 | U6_RFBT.2 U6_RFBB.1
U6_SW
  Top 0.203: U6.P$5 64.75,41.35 U6_CBST.2
  pour Top (rank 2, no thermals): 64.64,40.58 64.64,36.89 65.41,36.13 67.56,36.13 67.56,37.46 67.25,37.78 65.66,37.78 64.9,38.54 64.9,40.58
VBAT
  pour Top (no thermals): 75.76,35.18 77.66,35.18 77.66,33.85 76.45,33.85 75.76,34.54
  pour Top: 60.93,50.47 59.41,50.47 58.17,49.17 56.67,47.68 60.93,47.68
  pour Top (no thermals): 76.99,28.09 73.58,28.09 73.33,27.84 73.86,27.3 75.31,27.3 75.79,27.79 76.99,27.79
VBAT_CON
  Top 0.381: 65.22,50.41 64.19,49.38
  Top 0.762: R8.1 56.69,49.94 58.22,51.47 62.09,51.47 64.19,49.38 64.19,48.53
VBAT_JST
  Top 0.762: J1.2 53.34,50.04 54.12,49.26 54.8,49.26 R8.2
VCC  (via drill 0.33, 0.38)
  Top 0.33: U6.P$4 66.28,38.62 v66.55,38.35 | U6.P$2 66.35,39.62 v66.55,39.81
  Top 0.381: 59.69,20.32 v55.88,16.51 | 77.93,19.81 79.98,17.75 | R6.2 45.63,11.11 v45.67,11.07
  Top 0.762: U1_L1.2 66.98,29.49 69.42,26.92 69.42,17.25 72.59,14.05 76.45,14.05 79.98,17.75 82.53,17.75 S1.P$2
  Bottom 0.33: v66.55,35.24 v66.55,38.35 v66.55,39.81
  Bottom 0.381: v55.88,16.51 55.88,15.99 51.82,11.96 46.55,11.96 v45.67,11.07
  pour Top (rank 2, no thermals): 62.55,17.78 62.55,20 62.23,20.32 62.23,25.4 67.31,25.4 67.31,31.75 59.69,31.75 59.69,20.32 62.23,17.78
  pour Top (rank 2, no thermals): 59.69,25.65 59.69,34.29 60.96,35.56 68.58,35.56 69.7,34.47 69.7,26.8 68.58,25.65
VUSB  (via drill 0.38)  (2 unrouted)
  Top 0.381: 73.47,29.63 v74.32,28.78 | v47.75,6.38 46.43,7.7 46.43,9.19 45.53,10.08 42.93,10.08 R5.2 R3.2
  Top 0.762: 83.63,38.1 81.59,40.14 78.42,40.14 76.57,41.99 76.57,44.61 77.47,45.52 J2.P$7 J2.P$8
  Bottom 0.381: v74.32,28.78 73.71,28.78 70.73,25.81 69.46,25.81 51.56,7.91 51.56,7.9 51.09,7.43 51.04,7.38 | 51.04,7.38 50.94,7.28 | 51.04,7.38 50.04,6.38 v47.75,6.38
  pour Top (no thermals): 84.07,33.21 84.07,35.18 80.39,35.18 80.39,33.78 80.96,33.21
  pour Top (no thermals): 76.15,29.39 77.32,29.39 77.83,29.9 78.54,29.9 78.79,29.69 78.21,29.11 76.15,29.11

### Text on the board
tNames: 5V | +5IN | SCK | SDA | 6V | 6V